# Altium project 2403_HDD_ROM_Emulator.PrjPcb
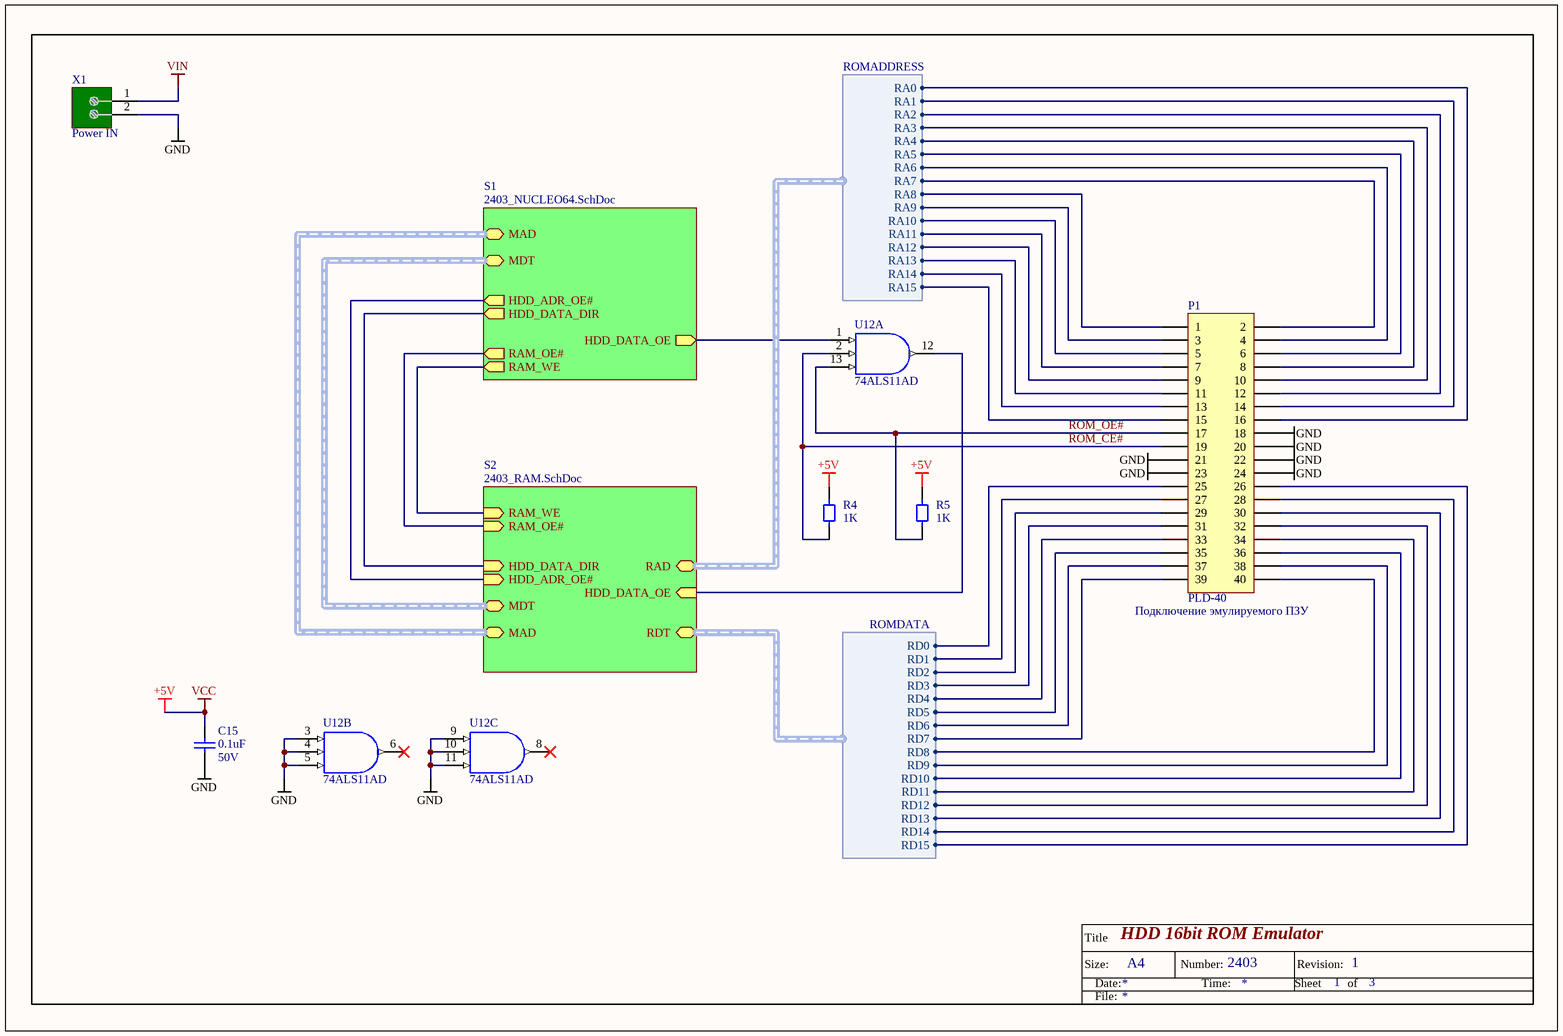
[diagram p0: 2403_HDD_ROM_Emulator.SchDoc]
3 sheets, 47 parts. Net scope: hierarchical (ports join the sheet entries above them; power ports are global).
Board file: 2403_HDD_ROM_Emulator.PcbDoc
Sheets:
  2403_HDD_ROM_Emulator.SchDoc
    S1 = 2403_NUCLEO64.SchDoc
    S2 = 2403_RAM.SchDoc

## Sheet 2403_HDD_ROM_Emulator.SchDoc: HDD 16bit ROM Emulator
size A4; DrawnBy: SY; Engineer: SY; Organization: R.LAB; DocumentNumber: 2403; Revision: 1; SheetNumber: 1; SheetTotal: 3

### Parts
C15  0.1uF  Rated Voltage: 50V  [0805_CAPC2013X100N]
P1  PLD-40  [PLD40_3M_2540-6002RB]
R4  1K  [0805_RESC2013X84N]
R5  1K  [0805_RESC2013X84N]
U12  74ALS11AD  [DIP14-300]  (parts A,B,C of 3)
X1  ConnectionName: Power IN  [PHOENIX_3.5mm]  (hidden comment: DG306-5.0 2)

### Sub-sheets
S1 = 2403_NUCLEO64.SchDoc: MAD (harness MCUADDR), MDT (harness MCUDAT), HDD_ADR_OE# (out), HDD_DATA_DIR (out), HDD_DATA_OE (out), RAM_WE (out), RAM_OE# (out)
S2 = 2403_RAM.SchDoc: RDT (harness ROMDATA), RAD (harness ROMADDRESS), MAD (harness MCUADDR), MDT (harness MCUDAT), HDD_ADR_OE# (in), HDD_DATA_DIR (in), HDD_DATA_OE (in), RAM_OE# (in), RAM_WE (in)

### Harnesses
ROMDATA: RD0, RD1, RD2, RD3, RD4, RD5, RD6, RD7, RD8, RD9, RD10, RD11, RD12, RD13, RD14, RD15
ROMADDRESS: RA0, RA1, RA2, RA3, RA4, RA5, RA6, RA7, RA8, RA9, RA10, RA11, RA12, RA13, RA14, RA15

### Nets
+5V: C15.2 R4.2 R5.2 U12.14(VCC)  [also labelled VCC]
GND: C15.1 P1.18 P1.20 P1.21 P1.22 P1.23 P1.24 U12.3(A) U12.4(B) U12.5(C) U12.7(GND) U12.9(A) U12.10(B) U12.11(C) X1.2
VIN: X1.1
ROM_CE#: P1.19 R4.1 U12.2(B)
ROM_OE#: P1.17 R5.1 U12.13(C)
NetP1_1: P1.1 ; sheet S2/RAD.RA8
NetP1_2: P1.2 ; sheet S2/RAD.RA7
NetP1_3: P1.3 ; sheet S2/RAD.RA9
NetP1_4: P1.4 ; sheet S2/RAD.RA6
NetP1_5: P1.5 ; sheet S2/RAD.RA10
NetP1_6: P1.6 ; sheet S2/RAD.RA5
NetP1_7: P1.7 ; sheet S2/RAD.RA11
NetP1_8: P1.8 ; sheet S2/RAD.RA4
NetP1_9: P1.9 ; sheet S2/RAD.RA12
NetP1_10: P1.10 ; sheet S2/RAD.RA3
NetP1_11: P1.11 ; sheet S2/RAD.RA13
NetP1_12: P1.12 ; sheet S2/RAD.RA2
NetP1_13: P1.13 ; sheet S2/RAD.RA14
NetP1_14: P1.14 ; sheet S2/RAD.RA1
NetP1_15: P1.15 ; sheet S2/RAD.RA15
NetP1_16: P1.16 ; sheet S2/RAD.RA0
NetP1_25: P1.25 ; sheet S2/RDT.RD0
NetP1_26: P1.26 ; sheet S2/RDT.RD15
NetP1_27: P1.27 ; sheet S2/RDT.RD1
NetP1_28: P1.28 ; sheet S2/RDT.RD14
NetP1_29: P1.29 ; sheet S2/RDT.RD2
NetP1_30: P1.30 ; sheet S2/RDT.RD13
NetP1_31: P1.31 ; sheet S2/RDT.RD3
NetP1_32: P1.32 ; sheet S2/RDT.RD12
NetP1_33: P1.33 ; sheet S2/RDT.RD4
NetP1_34: P1.34 ; sheet S2/RDT.RD11
NetP1_35: P1.35 ; sheet S2/RDT.RD5
NetP1_36: P1.36 ; sheet S2/RDT.RD10
NetP1_37: P1.37 ; sheet S2/RDT.RD6
NetP1_38: P1.38 ; sheet S2/RDT.RD9
NetP1_39: P1.39 ; sheet S2/RDT.RD7
NetP1_40: P1.40 ; sheet S2/RDT.RD8
NetR1_1: sheet S1/HDD_DATA_DIR, sheet S2/HDD_DATA_DIR
NetU5_3: sheet S1/HDD_ADR_OE#, sheet S2/HDD_ADR_OE#
NetU5_5: U12.1(A) ; sheet S1/HDD_DATA_OE
NetU5_6: sheet S1/RAM_WE, sheet S2/RAM_WE
NetU5_7: sheet S1/RAM_OE#, sheet S2/RAM_OE#
NetU10_19: U12.12(Y) ; sheet S2/HDD_DATA_OE

Not connected (* = marked no-connect by the designer): U12 6(Y)* 8(Y)*

### Buses and harness runs
harness sheet S1/MAD = sheet S2/MAD
harness sheet S1/MDT = sheet S2/MDT

### Notes on the sheet
- (near P1) Подключение эмулируемого ПЗУ
- Title
- Size:
- Date:
- A4
- Number:
- Time:
- Sheet
- Revision:
- of
- File:

### Library data of the parts
C15 = Cap SMD: Capacitor SMD; Suppler: chips; VALUE: 0.1uF; PackageReference: 0805; Publisher: SY; Price: 1
P1 = PLD-40: 40pin 2.54mm pitch plug; Suppler: PP; Publisher: SY; Price: ?; Source: 2403
R4 R5 = Resistor SMD L: SMD Resistor; Tolerance: 5%; Power: 0.1W; VALUE: 1K; Publisher: SY; Price: *; Suppler: *; Package: 0805
U12 = 74ALS11AD: К1533ЛИ3 Triple 3-Input Positive-AND Gate; Suppler: RR; Price: ?; Publisher: SY; Source: 2403_HDD_ROM_Emulator
X1 = CON_Plug2: 2pin connector; Suppler: promelec; Publisher: SY; Price: 5?

## Sheet 2403_NUCLEO64.SchDoc: STM32 NUCLEO64
size A4; Organization: R.LAB; DocumentNumber: 2403; Revision: 1; SheetNumber: 2; SheetTotal: 3
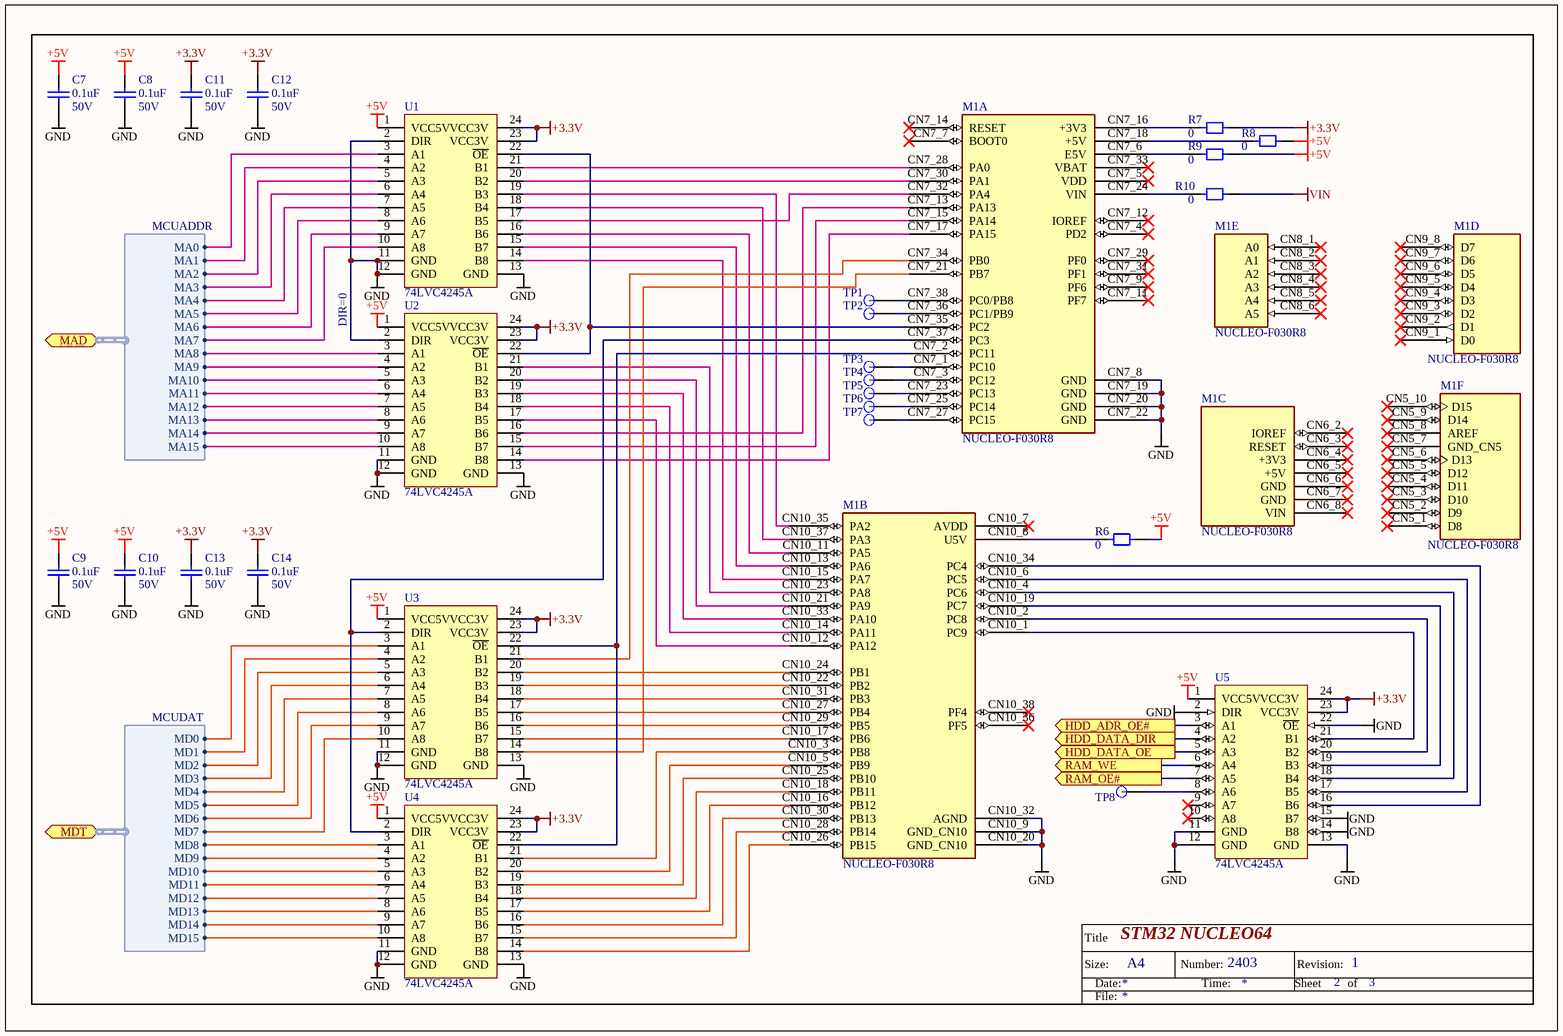
[diagram p1: 2403_NUCLEO64.SchDoc]

### Parts
C7  0.1uF  Rated Voltage: 50V  [0805_CAPC2013X100N]
C8  0.1uF  Rated Voltage: 50V  [0805_CAPC2013X100N]
C9  0.1uF  Rated Voltage: 50V  [0805_CAPC2013X100N]
C10  0.1uF  Rated Voltage: 50V  [0805_CAPC2013X100N]
C11  0.1uF  Rated Voltage: 50V  [0805_CAPC2013X100N]
C12  0.1uF  Rated Voltage: 50V  [0805_CAPC2013X100N]
C13  0.1uF  Rated Voltage: 50V  [0805_CAPC2013X100N]
C14  0.1uF  Rated Voltage: 50V  [0805_CAPC2013X100N]
M1  NUCLEO-F030R8  [MODULE_NUCLEO-F030R8]  (parts A,B,C,D,E,F of 6)
R6  0  [0805_RESC2013X84N]
R7  0  [0805_RESC2013X84N]
R8  0  [0805_RESC2013X84N]
R9  0  [0805_RESC2013X84N]
R10  0  [0805_RESC2013X84N]
TP1  TEST_POINT  [TEST2]  (value not drawn)
TP2  TEST_POINT  [TEST2]  (value not drawn)
TP3  TEST_POINT  [TEST2]  (value not drawn)
TP4  TEST_POINT  [TEST2]  (value not drawn)
TP5  TEST_POINT  [TEST2]  (value not drawn)
TP6  TEST_POINT  [TEST2]  (value not drawn)
TP7  TEST_POINT  [TEST2]  (value not drawn)
TP8  TEST_POINT  [TEST2]  (value not drawn)
U1  74LVC4245A  [SOIC127P1032X265-24N]
U2  74LVC4245A  [SOIC127P1032X265-24N]
U3  74LVC4245A  [SOIC127P1032X265-24N]
U4  74LVC4245A  [SOIC127P1032X265-24N]
U5  74LVC4245A  [SOIC127P1032X265-24N]

### Ports
HDD_ADR_OE# (out), HDD_DATA_DIR (out), HDD_DATA_OE (out), MAD (harness MCUADDR), MDT (harness MCUDAT), RAM_OE# (out), RAM_WE (out)

### Harnesses
MCUADDR: MA0, MA1, MA2, MA3, MA4, MA5, MA6, MA7, MA8, MA9, MA10, MA11, MA12, MA13, MA14, MA15
MCUDAT: MD0, MD1, MD2, MD3, MD4, MD5, MD6, MD7, MD8, MD9, MD10, MD11, MD12, MD13, MD14, MD15

### Nets
+3.3V: C11.2 C12.2 C13.2 C14.2 R7.2 U1.23(VCC3V) U1.24(VCC3V) U2.23(VCC3V) U2.24(VCC3V) U3.23(VCC3V) U3.24(VCC3V) U4.23(VCC3V) U4.24(VCC3V) U5.23(VCC3V) U5.24(VCC3V)
+5V: C7.2 C8.2 C9.2 C10.2 R6.2 R8.2 R9.2 U1.1(VCC5V) U2.1(VCC5V) U3.1(VCC5V) U4.1(VCC5V) U5.1(VCC5V)
GND: C7.1 C8.1 C9.1 C10.1 C11.1 C12.1 C13.1 C14.1 M1.CN7_8(GND) M1.CN7_19(GND) M1.CN7_20(GND) M1.CN7_22(GND) M1.CN10_9(GND_CN10) M1.CN10_20(GND_CN10) M1.CN10_32(AGND) U1.2(DIR) U1.11(GND) U1.12(GND) U1.13(GND) U2.2(DIR) U2.11(GND) U2.12(GND) U2.13(GND) U3.11(GND) U3.12(GND) U3.13(GND) U4.11(GND) U4.12(GND) U4.13(GND) U5.2(DIR) U5.11(GND) U5.12(GND) U5.13(GND) U5.14(B8) U5.15(B7) U5.22(~{OE})
VIN: R10.2
A0: U1.3(A1) ; port MAD.MA0
A1: U1.4(A2) ; port MAD.MA1
A2: U1.5(A3) ; port MAD.MA2
A3: U1.6(A4) ; port MAD.MA3
A4: U1.7(A5) ; port MAD.MA4
A5: U1.8(A6) ; port MAD.MA5
A6: U1.9(A7) ; port MAD.MA6
A7: U1.10(A8) ; port MAD.MA7
A8: U2.3(A1) ; port MAD.MA8
A9: U2.4(A2) ; port MAD.MA9
A10: U2.5(A3) ; port MAD.MA10
A11: U2.6(A4) ; port MAD.MA11
A12: U2.7(A5) ; port MAD.MA12
A13: U2.8(A6) ; port MAD.MA13
A14: U2.9(A7) ; port MAD.MA14
A15: U2.10(A8) ; port MAD.MA15
D0: U3.3(A1) ; port MDT.MD0
D1: U3.4(A2) ; port MDT.MD1
D2: U3.5(A3) ; port MDT.MD2
D3: U3.6(A4) ; port MDT.MD3
D4: U3.7(A5) ; port MDT.MD4
D5: U3.8(A6) ; port MDT.MD5
D6: U3.9(A7) ; port MDT.MD6
D7: U3.10(A8) ; port MDT.MD7
D8: U4.3(A1) ; port MDT.MD8
D9: U4.4(A2) ; port MDT.MD9
D10: U4.5(A3) ; port MDT.MD10
D11: U4.6(A4) ; port MDT.MD11
D12: U4.7(A5) ; port MDT.MD12
D13: U4.8(A6) ; port MDT.MD13
D14: U4.9(A7) ; port MDT.MD14
D15: U4.10(A8) ; port MDT.MD15
NetM1_CN7_1: M1.CN7_1(PC10) TP3.1(T)
NetM1_CN7_2: M1.CN7_2(PC11) U3.22(~{OE}) U4.22(~{OE})
NetM1_CN7_3: M1.CN7_3(PC12) TP4.1(T)
NetM1_CN7_6: M1.CN7_6(E5V) R9.1
NetM1_CN7_13: M1.CN7_13(PA13) U2.16(B6)
NetM1_CN7_15: M1.CN7_15(PA14) U2.15(B7)
NetM1_CN7_16: M1.CN7_16(+3V3) R7.1
NetM1_CN7_17: M1.CN7_17(PA15) U2.14(B8)
NetM1_CN7_18: M1.CN7_18(+5V) R8.1
NetM1_CN7_21: M1.CN7_21(PB7) U3.14(B8)
NetM1_CN7_23: M1.CN7_23(PC13) TP5.1(T)
NetM1_CN7_24: M1.CN7_24(VIN) R10.1
NetM1_CN7_25: M1.CN7_25(PC14) TP6.1(T)
NetM1_CN7_27: M1.CN7_27(PC15) TP7.1(T)
NetM1_CN7_28: M1.CN7_28(PA0) U1.21(B1)
NetM1_CN7_30: M1.CN7_30(PA1) U1.20(B2)
NetM1_CN7_32: M1.CN7_32(PA4) U1.17(B5)
NetM1_CN7_34: M1.CN7_34(PB0) U3.21(B1)
NetM1_CN7_35: M1.CN7_35(PC2) U1.22(~{OE}) U2.22(~{OE})
NetM1_CN7_36: M1.CN7_36(PC1/PB9) TP2.1(T)
NetM1_CN7_37: M1.CN7_37(PC3) U3.2(DIR) U4.2(DIR)
NetM1_CN7_38: M1.CN7_38(PC0/PB8) TP1.1(T)
NetM1_CN10_1: M1.CN10_1(PC9) U5.21(B1)
NetM1_CN10_2: M1.CN10_2(PC8) U5.20(B2)
NetM1_CN10_3: M1.CN10_3(PB8) U4.21(B1)
NetM1_CN10_4: M1.CN10_4(PC6) U5.18(B4)
NetM1_CN10_5: M1.CN10_5(PB9) U4.20(B2)
NetM1_CN10_6: M1.CN10_6(PC5) U5.17(B5)
NetM1_CN10_8: M1.CN10_8(U5V) R6.1
NetM1_CN10_11: M1.CN10_11(PA5) U1.16(B6)
NetM1_CN10_12: M1.CN10_12(PA12) U2.17(B5)
NetM1_CN10_13: M1.CN10_13(PA6) U1.15(B7)
NetM1_CN10_14: M1.CN10_14(PA11) U2.18(B4)
NetM1_CN10_15: M1.CN10_15(PA7) U1.14(B8)
NetM1_CN10_16: M1.CN10_16(PB12) U4.17(B5)
NetM1_CN10_17: M1.CN10_17(PB6) U3.15(B7)
NetM1_CN10_18: M1.CN10_18(PB11) U4.18(B4)
NetM1_CN10_19: M1.CN10_19(PC7) U5.19(B3)
NetM1_CN10_21: M1.CN10_21(PA9) U2.20(B2)
NetM1_CN10_22: M1.CN10_22(PB2) U3.19(B3)
NetM1_CN10_23: M1.CN10_23(PA8) U2.21(B1)
NetM1_CN10_24: M1.CN10_24(PB1) U3.20(B2)
NetM1_CN10_25: M1.CN10_25(PB10) U4.19(B3)
NetM1_CN10_26: M1.CN10_26(PB15) U4.14(B8)
NetM1_CN10_27: M1.CN10_27(PB4) U3.17(B5)
NetM1_CN10_28: M1.CN10_28(PB14) U4.15(B7)
NetM1_CN10_29: M1.CN10_29(PB5) U3.16(B6)
NetM1_CN10_30: M1.CN10_30(PB13) U4.16(B6)
NetM1_CN10_31: M1.CN10_31(PB3) U3.18(B4)
NetM1_CN10_33: M1.CN10_33(PA10) U2.19(B3)
NetM1_CN10_34: M1.CN10_34(PC4) U5.16(B6)
NetM1_CN10_35: M1.CN10_35(PA2) U1.19(B3)
NetM1_CN10_37: M1.CN10_37(PA3) U1.18(B4)
NetR1_1: U5.4(A2) ; port HDD_DATA_DIR
NetTP8_1: TP8.1(T) U5.8(A6)
NetU5_3: U5.3(A1) ; port HDD_ADR_OE#
NetU5_5: U5.5(A3) ; port HDD_DATA_OE
NetU5_6: U5.6(A4) ; port RAM_WE
NetU5_7: U5.7(A5) ; port RAM_OE#

Not connected (* = marked no-connect by the designer): M1 CN5_1(D8)* CN5_2(D9)* CN5_3(D10)* CN5_4(D11)* CN5_5(D12)* CN5_6(D13)* CN5_7(GND_CN5)* CN5_8(AREF)* CN5_9(D14)* CN5_10(D15)* CN6_2(IOREF)* CN6_3(RESET)* CN6_4(+3V3)* CN6_5(+5V)* CN6_6(GND)* CN6_7(GND)* CN6_8(VIN)* CN7_4(PD2)* CN7_5(VDD)* CN7_7(BOOT0)* CN7_9(PF6)* CN7_11(PF7)* CN7_12(IOREF)* CN7_14(RESET)* CN7_29(PF0)* CN7_31(PF1)* CN7_33(VBAT)* CN8_1(A0)* CN8_2(A1)* CN8_3(A2)* CN8_4(A3)* CN8_5(A4)* CN8_6(A5)* CN9_1(D0)* CN9_2(D1)* CN9_3(D2)* CN9_4(D3)* CN9_5(D4)* CN9_6(D5)* CN9_7(D6)* CN9_8(D7)* CN10_7(AVDD)* CN10_36(PF5)* CN10_38(PF4)*; U5 9(A7)* 10(A8)*

### Notes on the sheet
- DIR=0
- Title
- Size:
- Date:
- A4
- Number:
- Time:
- Sheet
- Revision:
- of
- File:

### Library data of the parts
C7-C14 = Cap SMD: Capacitor SMD; Suppler: chips; VALUE: 0.1uF; PackageReference: 0805; Publisher: SY; Price: 1
M1 = NUCLEO-F030R8: STM32F030R8, mbed-Enabled Development Nucleo-64 STM32F0 ARM® Cortex®-M0 MCU 32-Bit Embedded Evaluation Board; MF: STMicroelectronics; Package: TSOT-23 STMicroelectronics; Price: None; SnapEDA_Link: https://www.snapeda.com/parts/NUCLEO-F030R8/STMicroelectronics/view-part/240805/?ref=snap; Availability: Unavailable; Value: *; MP: NUCLEO-F030R8; Publisher: SY
R6-R10 = Resistor SMD L: SMD Resistor; Tolerance: 5%; Power: 0.1W; VALUE: 0; Publisher: SY; Price: *; Suppler: *; Package: 0805
TP1-TP8 = TEST_POINT: Test point; Publisher: SY
U1-U5 = 74LVC4245A: Octal Bus Transceiver and 3.3-V to 5-V Shifter / With 3-State Outputs; Suppler: ChipDip; Publisher: SY; Source: Renishaw MP12; Price: ?

## Sheet 2403_RAM.SchDoc: RAM
size A4; DrawnBy: SY; Engineer: SY; Organization: R.LAB; DocumentNumber: 2403; Revision: 1; SheetNumber: 3; SheetTotal: 3
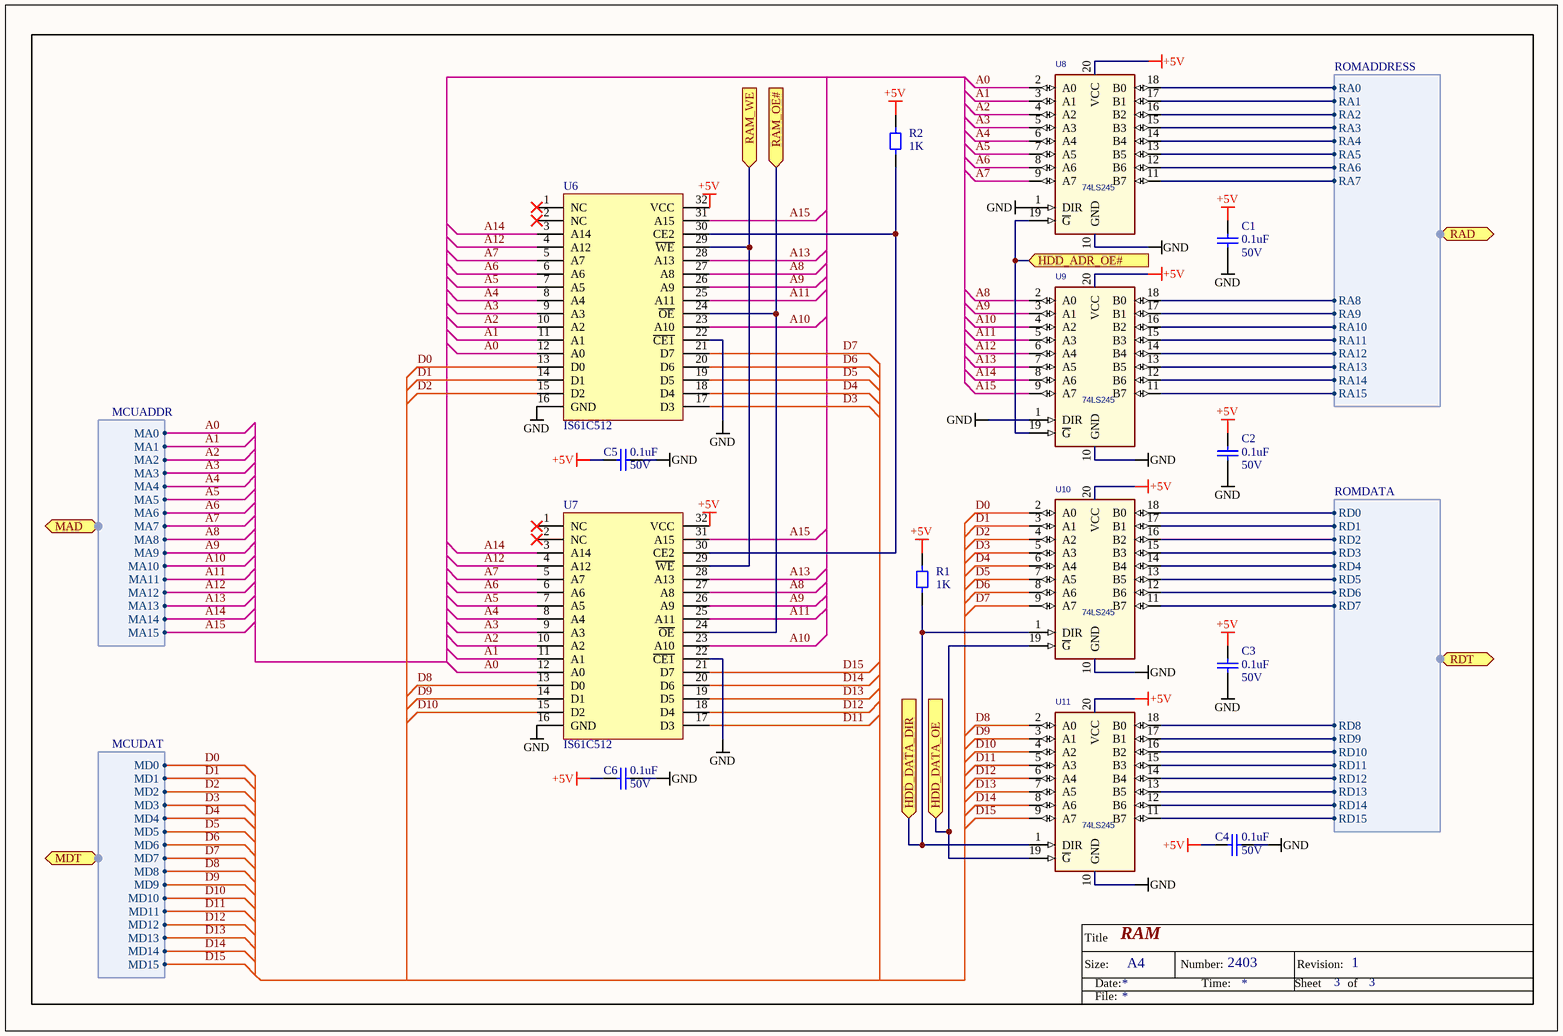
[diagram p2: 2403_RAM.SchDoc]

### Parts
C1  0.1uF  Rated Voltage: 50V  [0805_CAPC2013X100N]
C2  0.1uF  Rated Voltage: 50V  [0805_CAPC2013X100N]
C3  0.1uF  Rated Voltage: 50V  [0805_CAPC2013X100N]
C4  0.1uF  Rated Voltage: 50V  [0805_CAPC2013X100N]
C5  0.1uF  Rated Voltage: 50V  [0805_CAPC2013X100N]
C6  0.1uF  Rated Voltage: 50V  [0805_CAPC2013X100N]
R1  1K  [0805_RESC2013X84N]
R2  1K  [0805_RESC2013X84N]
U6  IS61C512  [DIP32-300]
U7  IS61C512  [DIP32-300]
U8  74LS245  [SOIC127P1030X265-20N]
U9  74LS245  [SOIC127P1030X265-20N]
U10  74LS245  [SOIC127P1030X265-20N]
U11  74LS245  [SOIC127P1030X265-20N]

### Ports
HDD_ADR_OE# (in), HDD_DATA_DIR (in), HDD_DATA_OE (in), MAD (harness MCUADDR), MDT (harness MCUDAT), RAD (harness ROMADDRESS), RAM_OE# (in), RAM_WE (in), RDT (harness ROMDATA)

### Harnesses
ROMDATA: RD0, RD1, RD2, RD3, RD4, RD5, RD6, RD7, RD8, RD9, RD10, RD11, RD12, RD13, RD14, RD15
ROMADDRESS: RA0, RA1, RA2, RA3, RA4, RA5, RA6, RA7, RA8, RA9, RA10, RA11, RA12, RA13, RA14, RA15
MCUADDR: MA0, MA1, MA2, MA3, MA4, MA5, MA6, MA7, MA8, MA9, MA10, MA11, MA12, MA13, MA14, MA15
MCUDAT: MD0, MD1, MD2, MD3, MD4, MD5, MD6, MD7, MD8, MD9, MD10, MD11, MD12, MD13, MD14, MD15

### Nets
+5V: C1.2 C2.2 C3.2 C4.2 C5.2 C6.2 R1.2 R2.2 U6.32(VCC) U7.32(VCC) U8.20(VCC) U9.20(VCC) U10.20(VCC) U11.20(VCC)  [also labelled VCC]
GND: C1.1 C2.1 C3.1 C4.1 C5.1 C6.1 U6.16(GND) U6.22(~{CE1}) U7.16(GND) U7.22(~{CE1}) U8.1(DIR) U8.10(GND) U9.1(DIR) U9.10(GND) U10.10(GND) U11.10(GND)
A0: U6.12(A0) U7.12(A0) U8.2(A0) ; port MAD.MA0
A1: U6.11(A1) U7.11(A1) U8.3(A1) ; port MAD.MA1
A2: U6.10(A2) U7.10(A2) U8.4(A2) ; port MAD.MA2
A3: U6.9(A3) U7.9(A3) U8.5(A3) ; port MAD.MA3
A4: U6.8(A4) U7.8(A4) U8.6(A4) ; port MAD.MA4
A5: U6.7(A5) U7.7(A5) U8.7(A5) ; port MAD.MA5
A6: U6.6(A6) U7.6(A6) U8.8(A6) ; port MAD.MA6
A7: U6.5(A7) U7.5(A7) U8.9(A7) ; port MAD.MA7
A8: U6.27(A8) U7.27(A8) U9.2(A0) ; port MAD.MA8
A9: U6.26(A9) U7.26(A9) U9.3(A1) ; port MAD.MA9
A10: U6.23(A10) U7.23(A10) U9.4(A2) ; port MAD.MA10
A11: U6.25(A11) U7.25(A11) U9.5(A3) ; port MAD.MA11
A12: U6.4(A12) U7.4(A12) U9.6(A4) ; port MAD.MA12
A13: U6.28(A13) U7.28(A13) U9.7(A5) ; port MAD.MA13
A14: U6.3(A14) U7.3(A14) U9.8(A6) ; port MAD.MA14
A15: U6.31(A15) U7.31(A15) U9.9(A7) ; port MAD.MA15
D0: U6.13(D0) U10.2(A0) ; port MDT.MD0
D1: U6.14(D1) U10.3(A1) ; port MDT.MD1
D2: U6.15(D2) U10.4(A2) ; port MDT.MD2
D3: U6.17(D3) U10.5(A3) ; port MDT.MD3
D4: U6.18(D4) U10.6(A4) ; port MDT.MD4
D5: U6.19(D5) U10.7(A5) ; port MDT.MD5
D6: U6.20(D6) U10.8(A6) ; port MDT.MD6
D7: U6.21(D7) U10.9(A7) ; port MDT.MD7
D8: U7.13(D0) U11.2(A0) ; port MDT.MD8
D9: U7.14(D1) U11.3(A1) ; port MDT.MD9
D10: U7.15(D2) U11.4(A2) ; port MDT.MD10
D11: U7.17(D3) U11.5(A3) ; port MDT.MD11
D12: U7.18(D4) U11.6(A4) ; port MDT.MD12
D13: U7.19(D5) U11.7(A5) ; port MDT.MD13
D14: U7.20(D6) U11.8(A6) ; port MDT.MD14
D15: U7.21(D7) U11.9(A7) ; port MDT.MD15
NetP1_1: U9.18(B0) ; port RAD.RA8
NetP1_2: U8.11(B7) ; port RAD.RA7
NetP1_3: U9.17(B1) ; port RAD.RA9
NetP1_4: U8.12(B6) ; port RAD.RA6
NetP1_5: U9.16(B2) ; port RAD.RA10
NetP1_6: U8.13(B5) ; port RAD.RA5
NetP1_7: U9.15(B3) ; port RAD.RA11
NetP1_8: U8.14(B4) ; port RAD.RA4
NetP1_9: U9.14(B4) ; port RAD.RA12
NetP1_10: U8.15(B3) ; port RAD.RA3
NetP1_11: U9.13(B5) ; port RAD.RA13
NetP1_12: U8.16(B2) ; port RAD.RA2
NetP1_13: U9.12(B6) ; port RAD.RA14
NetP1_14: U8.17(B1) ; port RAD.RA1
NetP1_15: U9.11(B7) ; port RAD.RA15
NetP1_16: U8.18(B0) ; port RAD.RA0
NetP1_25: U10.18(B0) ; port RDT.RD0
NetP1_26: U11.11(B7) ; port RDT.RD15
NetP1_27: U10.17(B1) ; port RDT.RD1
NetP1_28: U11.12(B6) ; port RDT.RD14
NetP1_29: U10.16(B2) ; port RDT.RD2
NetP1_30: U11.13(B5) ; port RDT.RD13
NetP1_31: U10.15(B3) ; port RDT.RD3
NetP1_32: U11.14(B4) ; port RDT.RD12
NetP1_33: U10.14(B4) ; port RDT.RD4
NetP1_34: U11.15(B3) ; port RDT.RD11
NetP1_35: U10.13(B5) ; port RDT.RD5
NetP1_36: U11.16(B2) ; port RDT.RD10
NetP1_37: U10.12(B6) ; port RDT.RD6
NetP1_38: U11.17(B1) ; port RDT.RD9
NetP1_39: U10.11(B7) ; port RDT.RD7
NetP1_40: U11.18(B0) ; port RDT.RD8
NetR1_1: R1.1 U10.1(DIR) U11.1(DIR) ; port HDD_DATA_DIR
NetR2_1: R2.1 U6.30(CE2) U7.30(CE2)
NetU5_3: U8.19(~{G}) U9.19(~{G}) ; port HDD_ADR_OE#
NetU5_6: U6.29(~{WE}) U7.29(~{WE}) ; port RAM_WE
NetU5_7: U6.24(~{OE}) U7.24(~{OE}) ; port RAM_OE#
NetU10_19: U10.19(~{G}) U11.19(~{G}) ; port HDD_DATA_OE

Not connected (* = marked no-connect by the designer): U6 1(NC)* 2(NC)*; U7 1(NC)* 2(NC)*

### Notes on the sheet
- Title
- Size:
- Date:
- A4
- Number:
- Time:
- Sheet
- Revision:
- of
- File:

### Library data of the parts
C1-C6 = Cap SMD: Capacitor SMD; Suppler: chips; VALUE: 0.1uF; PackageReference: 0805; Publisher: SY; Price: 1
R1 R2 = Resistor SMD L: SMD Resistor; Tolerance: 5%; Power: 0.1W; VALUE: 1K; Publisher: SY; Price: *; Suppler: *; Package: 0805
U6 U7 = IS61C512: 64KB static RAM; Suppler: xlam; Source: 2403; Publisher: SY; Price: 0
U8-U11 = 74ABT245: Bus former; Suppler: xlam; Publisher: SY; Price: ?

## Nets that join several sheets
+5V: 2403_HDD_ROM_Emulator (C15.2 R4.2 R5.2 U12.14), 2403_NUCLEO64 (12 pins), 2403_RAM (14 pins)
GND: 2403_HDD_ROM_Emulator (15 pins), 2403_NUCLEO64 (36 pins), 2403_RAM (16 pins)
VIN: 2403_HDD_ROM_Emulator (X1.1), 2403_NUCLEO64 (R10.2)
A0: 2403_NUCLEO64 (U1.3), 2403_RAM (U6.12 U7.12 U8.2)
A1: 2403_NUCLEO64 (U1.4), 2403_RAM (U6.11 U7.11 U8.3)
A2: 2403_NUCLEO64 (U1.5), 2403_RAM (U6.10 U7.10 U8.4)
A3: 2403_NUCLEO64 (U1.6), 2403_RAM (U6.9 U7.9 U8.5)
A4: 2403_NUCLEO64 (U1.7), 2403_RAM (U6.8 U7.8 U8.6)
A5: 2403_NUCLEO64 (U1.8), 2403_RAM (U6.7 U7.7 U8.7)
A6: 2403_NUCLEO64 (U1.9), 2403_RAM (U6.6 U7.6 U8.8)
A7: 2403_NUCLEO64 (U1.10), 2403_RAM (U6.5 U7.5 U8.9)
A8: 2403_NUCLEO64 (U2.3), 2403_RAM (U6.27 U7.27 U9.2)
A9: 2403_NUCLEO64 (U2.4), 2403_RAM (U6.26 U7.26 U9.3)
A10: 2403_NUCLEO64 (U2.5), 2403_RAM (U6.23 U7.23 U9.4)
A11: 2403_NUCLEO64 (U2.6), 2403_RAM (U6.25 U7.25 U9.5)
A12: 2403_NUCLEO64 (U2.7), 2403_RAM (U6.4 U7.4 U9.6)
A13: 2403_NUCLEO64 (U2.8), 2403_RAM (U6.28 U7.28 U9.7)
A14: 2403_NUCLEO64 (U2.9), 2403_RAM (U6.3 U7.3 U9.8)
A15: 2403_NUCLEO64 (U2.10), 2403_RAM (U6.31 U7.31 U9.9)
D0: 2403_NUCLEO64 (U3.3), 2403_RAM (U6.13 U10.2)
D1: 2403_NUCLEO64 (U3.4), 2403_RAM (U6.14 U10.3)
D2: 2403_NUCLEO64 (U3.5), 2403_RAM (U6.15 U10.4)
D3: 2403_NUCLEO64 (U3.6), 2403_RAM (U6.17 U10.5)
D4: 2403_NUCLEO64 (U3.7), 2403_RAM (U6.18 U10.6)
D5: 2403_NUCLEO64 (U3.8), 2403_RAM (U6.19 U10.7)
D6: 2403_NUCLEO64 (U3.9), 2403_RAM (U6.20 U10.8)
D7: 2403_NUCLEO64 (U3.10), 2403_RAM (U6.21 U10.9)
D8: 2403_NUCLEO64 (U4.3), 2403_RAM (U7.13 U11.2)
D9: 2403_NUCLEO64 (U4.4), 2403_RAM (U7.14 U11.3)
D10: 2403_NUCLEO64 (U4.5), 2403_RAM (U7.15 U11.4)
D11: 2403_NUCLEO64 (U4.6), 2403_RAM (U7.17 U11.5)
D12: 2403_NUCLEO64 (U4.7), 2403_RAM (U7.18 U11.6)
D13: 2403_NUCLEO64 (U4.8), 2403_RAM (U7.19 U11.7)
D14: 2403_NUCLEO64 (U4.9), 2403_RAM (U7.20 U11.8)
D15: 2403_NUCLEO64 (U4.10), 2403_RAM (U7.21 U11.9)
NetP1_1: 2403_HDD_ROM_Emulator (P1.1), 2403_RAM (U9.18)
NetP1_2: 2403_HDD_ROM_Emulator (P1.2), 2403_RAM (U8.11)
NetP1_3: 2403_HDD_ROM_Emulator (P1.3), 2403_RAM (U9.17)
NetP1_4: 2403_HDD_ROM_Emulator (P1.4), 2403_RAM (U8.12)
NetP1_5: 2403_HDD_ROM_Emulator (P1.5), 2403_RAM (U9.16)
NetP1_6: 2403_HDD_ROM_Emulator (P1.6), 2403_RAM (U8.13)
NetP1_7: 2403_HDD_ROM_Emulator (P1.7), 2403_RAM (U9.15)
NetP1_8: 2403_HDD_ROM_Emulator (P1.8), 2403_RAM (U8.14)
NetP1_9: 2403_HDD_ROM_Emulator (P1.9), 2403_RAM (U9.14)
NetP1_10: 2403_HDD_ROM_Emulator (P1.10), 2403_RAM (U8.15)
NetP1_11: 2403_HDD_ROM_Emulator (P1.11), 2403_RAM (U9.13)
NetP1_12: 2403_HDD_ROM_Emulator (P1.12), 2403_RAM (U8.16)
NetP1_13: 2403_HDD_ROM_Emulator (P1.13), 2403_RAM (U9.12)
NetP1_14: 2403_HDD_ROM_Emulator (P1.14), 2403_RAM (U8.17)
NetP1_15: 2403_HDD_ROM_Emulator (P1.15), 2403_RAM (U9.11)
NetP1_16: 2403_HDD_ROM_Emulator (P1.16), 2403_RAM (U8.18)
NetP1_25: 2403_HDD_ROM_Emulator (P1.25), 2403_RAM (U10.18)
NetP1_26: 2403_HDD_ROM_Emulator (P1.26), 2403_RAM (U11.11)
NetP1_27: 2403_HDD_ROM_Emulator (P1.27), 2403_RAM (U10.17)
NetP1_28: 2403_HDD_ROM_Emulator (P1.28), 2403_RAM (U11.12)
NetP1_29: 2403_HDD_ROM_Emulator (P1.29), 2403_RAM (U10.16)
NetP1_30: 2403_HDD_ROM_Emulator (P1.30), 2403_RAM (U11.13)
NetP1_31: 2403_HDD_ROM_Emulator (P1.31), 2403_RAM (U10.15)
NetP1_32: 2403_HDD_ROM_Emulator (P1.32), 2403_RAM (U11.14)
NetP1_33: 2403_HDD_ROM_Emulator (P1.33), 2403_RAM (U10.14)
NetP1_34: 2403_HDD_ROM_Emulator (P1.34), 2403_RAM (U11.15)
NetP1_35: 2403_HDD_ROM_Emulator (P1.35), 2403_RAM (U10.13)
NetP1_36: 2403_HDD_ROM_Emulator (P1.36), 2403_RAM (U11.16)
NetP1_37: 2403_HDD_ROM_Emulator (P1.37), 2403_RAM (U10.12)
NetP1_38: 2403_HDD_ROM_Emulator (P1.38), 2403_RAM (U11.17)
NetP1_39: 2403_HDD_ROM_Emulator (P1.39), 2403_RAM (U10.11)
NetP1_40: 2403_HDD_ROM_Emulator (P1.40), 2403_RAM (U11.18)
NetR1_1: 2403_NUCLEO64 (U5.4), 2403_RAM (R1.1 U10.1 U11.1)
NetU5_3: 2403_NUCLEO64 (U5.3), 2403_RAM (U8.19 U9.19)
NetU5_5: 2403_HDD_ROM_Emulator (U12.1), 2403_NUCLEO64 (U5.5)
NetU5_6: 2403_NUCLEO64 (U5.6), 2403_RAM (U6.29 U7.29)
NetU5_7: 2403_NUCLEO64 (U5.7), 2403_RAM (U6.24 U7.24)
NetU10_19: 2403_HDD_ROM_Emulator (U12.12), 2403_RAM (U10.19 U11.19)